# Altium schematic sheet LT6813.SchDoc
size A3; SheetNumber: 5; SheetTotal: 5
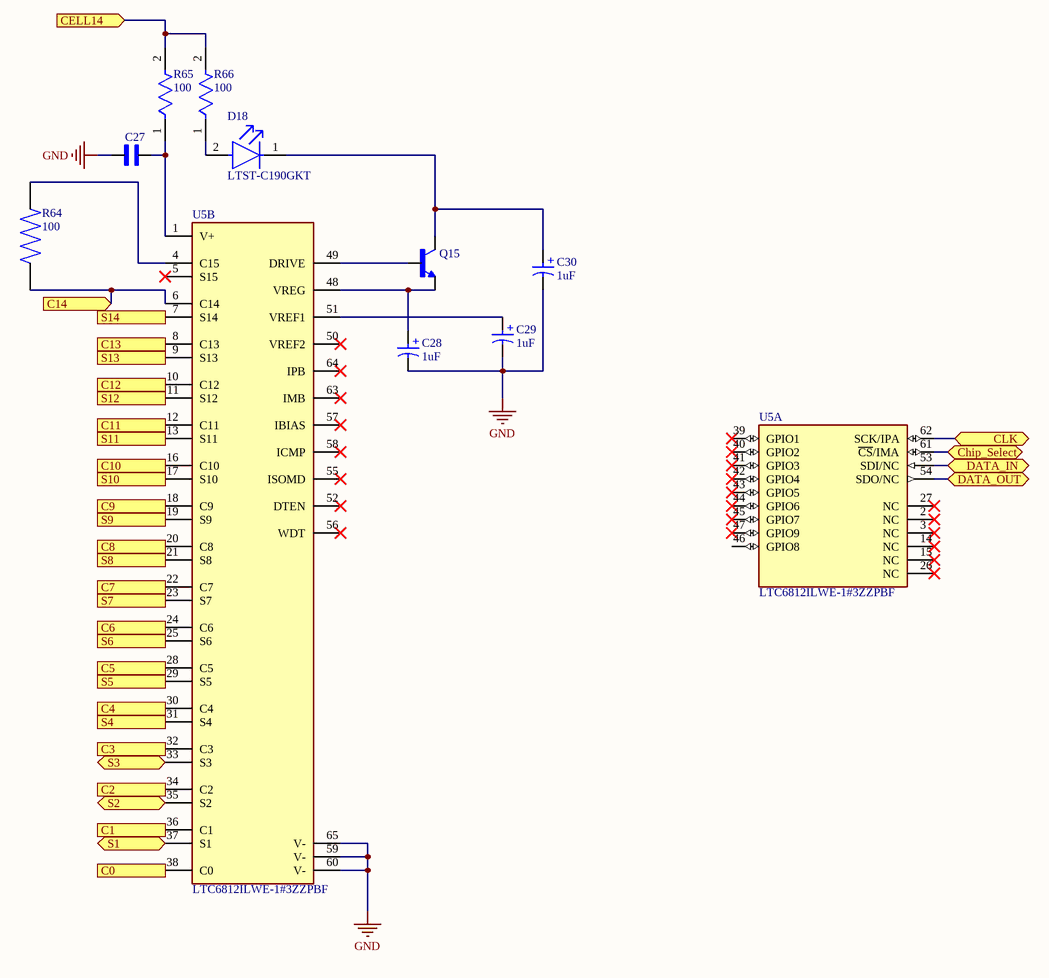
[diagram p0: LT6813.SchDoc]

## Parts
C27  GRM155R71C104KA88D  [CAPC1005X55N]  (value not drawn)
C28  1uF  [WCAP-ASLI_D4H5.5]
C29  1uF  [WCAP-ASLI_D4H5.5]
C30  1uF  [WCAP-ASLI_D4H5.5]
D18  LTST-C190GKT  [FP-LTST-C190GKT-MFG]
Q15  DXT5551P5-13  [TRANS_DXT5551P5-13]  (value not drawn)
R64  100  [RES_ERJ2RKF1000X]
R65  100  [FP-CRCW0402-e3-IPC_C]
R66  100  [FP-CRCW0402-e3-IPC_C]
U5  LTC6812ILWE-1#3ZZPBF  [FP-LWE-64-05-08-1982-MFG]  (parts A,B of 2)

## Ports
C0 (in), C1 (in), C2 (in), C3 (out), C4 (in), C5 (in), C6 (in), C7 (in), C8 (in), C9 (in), C10 (in), C11 (in), C12 (in), C13 (in), C14 (in), CELL14 (in), Chip_Select (bidir), CLK (bidir), DATA_IN (bidir), DATA_OUT (bidir), S1 (bidir), S2 (bidir), S3 (bidir), S4 (in), S5 (in), S6 (in), S7 (in), S8 (in), S9 (in), S10 (in), S11 (in), S12 (in), S13 (in), S14 (in)

## Nets
GND: C27.1 C28.2(N) C29.2(N) C30.2(N) U5.59(V-) U5.60(V-) U5.65(V-)
C0: U5.38(C0) ; port C0
C1: U5.36(C1) ; port C1
C2: U5.34(C2) ; port C2
C3: U5.32(C3) ; port C3
C4: U5.30(C4) ; port C4
C5: U5.28(C5) ; port C5
C6: U5.24(C6) ; port C6
C7: U5.22(C7) ; port C7
C8: U5.20(C8) ; port C8
C9: U5.18(C9) ; port C9
C10: U5.16(C10) ; port C10
C11: U5.12(C11) ; port C11
C12: U5.10(C12) ; port C12
C13: U5.8(C13) ; port C13
C14: R64.1 U5.6(C14) ; port C14
CELL14: R65.2 R66.2 ; port CELL14
Chip_Select: U5.61(~{CS}/IMA) ; port Chip_Select
CLK: U5.62(SCK/IPA) ; port CLK
DATA_IN: U5.53(SDI/NC) ; port DATA_IN
DATA_OUT: U5.54(SDO/NC) ; port DATA_OUT
S1: U5.37(S1) ; port S1
S2: U5.35(S2) ; port S2
S3: U5.33(S3) ; port S3
S4: U5.31(S4) ; port S4
S5: U5.29(S5) ; port S5
S6: U5.25(S6) ; port S6
S7: U5.23(S7) ; port S7
S8: U5.21(S8) ; port S8
S9: U5.19(S9) ; port S9
S10: U5.17(S10) ; port S10
S11: U5.13(S11) ; port S11
S12: U5.11(S12) ; port S12
S13: U5.9(S13) ; port S13
S14: U5.7(S14) ; port S14
NetC27_2: C27.2 R65.1 U5.1(V+)
NetC28_1: C28.1(P) Q15.E U5.48(VREG)
NetC29_1: C29.1(P) U5.51(VREF1)
NetC30_1: C30.1(P) D18.1(C) Q15.C
NetD18_2: D18.2(A) R66.1
NetQ15_B: Q15.B U5.49(DRIVE)
NetR64_2: R64.2 U5.4(C15)

Not connected (* = marked no-connect by the designer): U5 2(NC)* 3(NC)* 5(S15)* 14(NC)* 15(NC)* 26(NC)* 27(NC)* 39(GPIO1)* 40(GPIO2)* 41(GPIO3)* 42(GPIO4)* 43(GPIO5)* 44(GPIO6)* 45(GPIO7)* 46(GPIO8) 47(GPIO9)* 50(VREF2)* 52(DTEN)* 55(ISOMD)* 56(WDT)* 57(IBIAS)* 58(ICMP)* 63(IMB)* 64(IPB)*

## Notes on the sheet
- (in symbol CMP-03913-130590197-1) +

## Library data of the parts
C27 = GRM155R71C104KA88D: CAP CER 0.1UF 16V 10% X7R 0402; MF: {'manufacturer': u'Murata'}; Package: None; Price: None; Value: *; MP: GRM155R71C104KA88D; Availability: Unavailable
C28-C30 = CMP-03913-130590197-1: 865080840001 Cap, 1Uf, 20%, 100V, Alu Elec Smd Rohs Compliant: Yes; Insulation Resistance: 33.3333MΩ; Capacitance: 1µF; Impedance: 20.381Ω; Leakage Current: 3µA; Ripple Current: 7mA; Width: 4.3mm; Min Operating Temperature: -55°C; NexarPartId: 130590197; RoHS: Compliant; Length: 5.5mm; Voltage Rating: 100V; Max Operating Temperature: 105°C; Diameter: 4mm
D18 = CMP-22017-000005-2: LED GREEN CLEAR CHIP SMD; Dominant Wavelength: 569nm; Reverse Voltage: 5V; Lens Color: Colorless; Viewing Angle: 130°; Voltage: 2V; Forward Current: 30mA; Power Dissipation: 100mW; Luminous Intensity: 6mcd; Number of LEDs: 1; Forward Voltage: 2.1V; Wavelength: 565nm; Test Current: 10mA; Min Operating Temperature: -55°C; Lens Style: Clear; Mount: Surface Mount; Width: 0.8mm; Packaging: Tape and Reel; Lens Transparency: Clear; Case Code (Metric): 1608; Depth: 0.8mm; Case Code (Imperial): 0603; Case/Package: 0603; Number of Pins: 2; Max Operating Temperature: 85°C; Lead Free: Lead Free; Number of Elements: 1; Length: 1.6mm; Height: 0.8mm; Package Quantity: 1; Power Rating: 100mW; Radiation Hardening: No; Illumination Color: Green; Color: Green
Q15 = DXT5551P5-13: MF: {'manufacturer': u'Diodes Inc.'}; Package: None; Price: None; Value: *; MP: DXT5551P5-13; Availability: Unavailable
R64 = ERJ2RKF1000X: MF: {'manufacturer': u'Panasonic'}; Package: None; Price: None; Value: *; MP: ERJ2RKF1000X; Availability: Unavailable
R65 R66 = CMP-1011-00397-3: RES Thick Film, 100Ω, 1%, 0.063W, 100ppm/°C, 0402; Max Power Dissipation: 63mW; Voltage Rating: 50V; Resistance: 100R; Package Quantity: 10; Lead Free: Lead Free; Termination: SMD/SMT; Case Code (Metric): 1005; Number of Terminations: 2; Composition: Thick Film; Voltage Rating (DC): 50V; Min Operating Temperature: -55°C; Case/Package: 0402; Radiation Hardening: No; Max Operating Temperature: 155°C; Temperature Coefficient: 100ppm/°C; Military Standard: Not; Length: 1mm; Mount: Surface Mount; Power Rating: 63mW; Weight: 2.3E-05oz; Working Voltage: 50V; Features: Automotive AEC-Q200; Depth: 0.5mm; Packaging: Tape and Reel; Tolerance: 1%; Height: 0.35mm; Case Code (Imperial): 0402; Width: 0.02inch; Contact Plating: Tin
U5 = CMP-09132-000006-1: MULTICELL BAT MON S; Manufacturer: Analog Devices; Nominal Supply Current: 3-6.1uA; Number Of Outputs: 9; Max Junction Temp: +150°C; Min Supply Voltage: 16V; Standoff Height: 0.05mm; Number Of Cells: 15; Automotive Grade: Grade 3; Max Supply Voltage: 75V; Temperature: -40°C to +85°C; Height: 1.6mm; Manufacturer Part Number: LTC6812ILWE-1#3ZZPBF; Category: IC; ComponentLink2Description: Datasheet; Digikey Description: MULTICELL BAT MON S; Device Class L1: Integrated Circuits (ICs); Temperature Range High: +85°C; Octopart: https://octopart.com/ltc6812ilwe-1%233zzpbf-analog+devices-97359568; Temperature Range Low: -40°C; Device Class L2: Power Management ICs; Package: LWE-64-05-08-1982; ComponentLink2URL: https://www.analog.com/media/en/technical-documentation/data-sheets/LTC6812-1.pdf; RoHS: TRUE; Ipc Land Pattern Name: QFP50P1200X1200X160-64; Lead Free: Yes; Automotive: Yes; Device Class L3: Battery Management